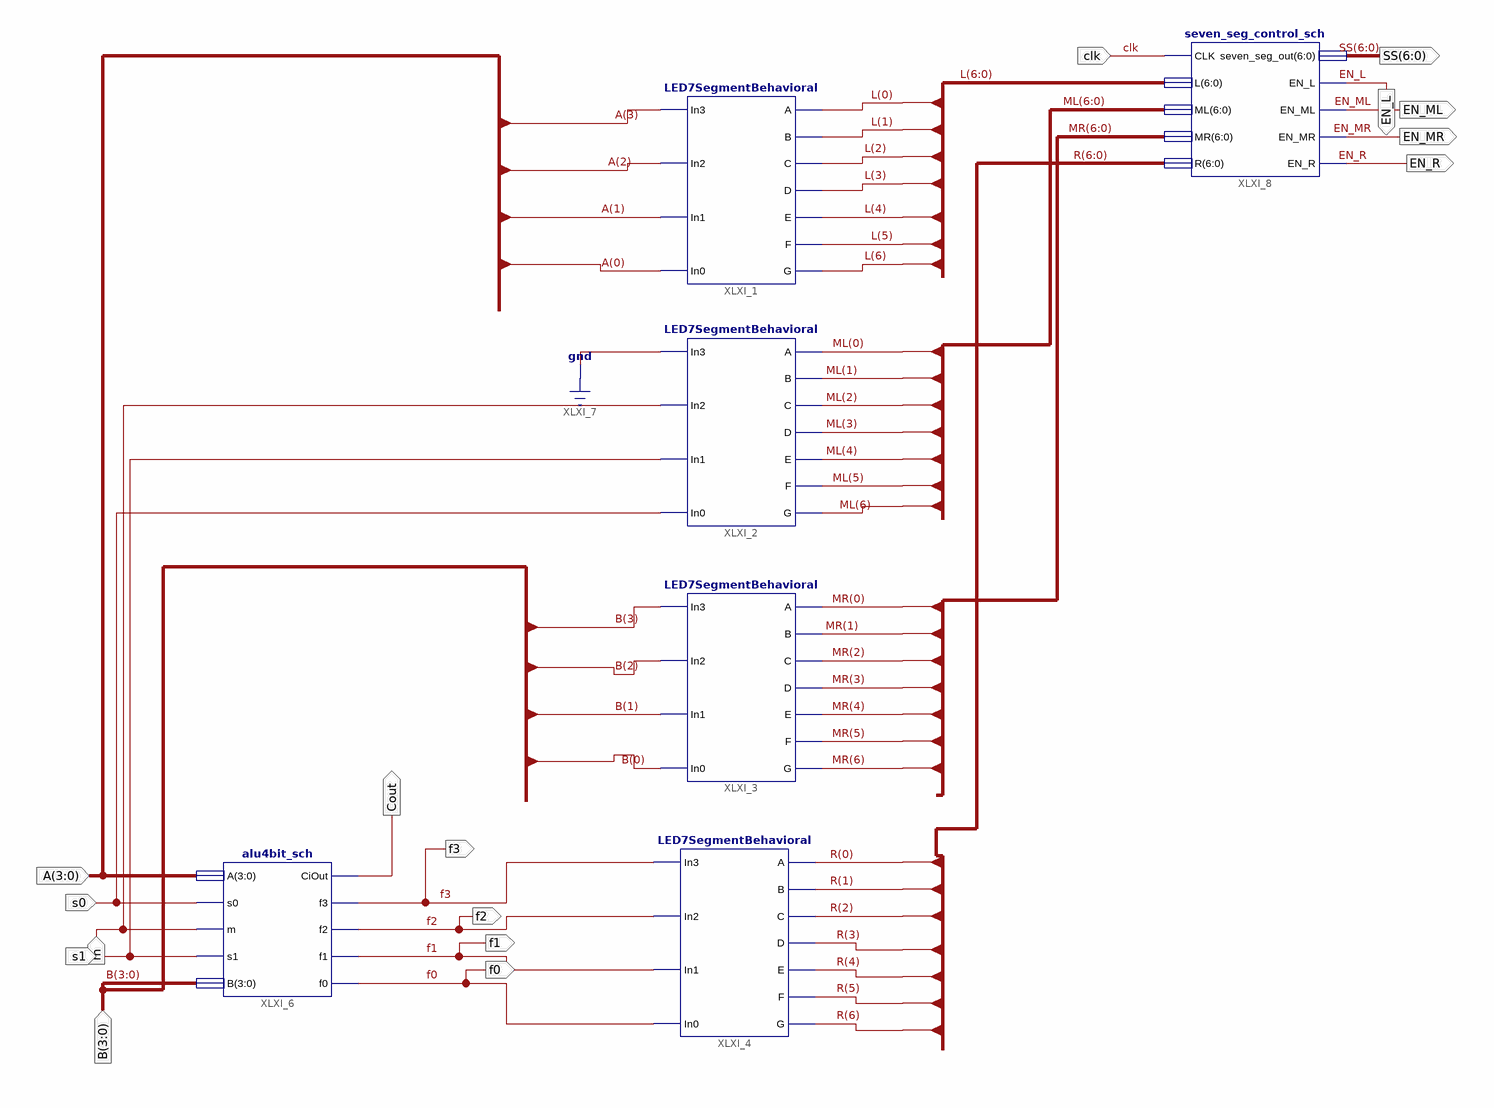
[diagram p0: schematic sheet 1]
// Xilinx ISE schematic alu4bit_board_sch.sch (spartan3e) as structural Verilog: 6 symbols, 16 ports
module alu4bit_board_sch (
  input  [3:0] A,
  input  s0,
  input  m,
  input  s1,
  input  clk,
  input  [3:0] B,
  output f3,
  output f2,
  output f1,
  output f0,
  output Cout,
  output [6:0] SS,
  output EN_L,
  output EN_ML,
  output EN_MR,
  output EN_R
);

  wire [6:0] L, ML, MR, R;

  LED7SegmentBehavioral XLXI_1 (
    .In3(A[3]), .In2(A[2]), .In1(A[1]), .In0(A[0]), .A(L[0]), .B(L[1]), .C(L[2]), .D(L[3]), .E(L[4]),
    .F(L[5]), .G(L[6]));
  LED7SegmentBehavioral XLXI_2 (
    .In3(1'b0), .In2(m), .In1(s1), .In0(s0), .A(ML[0]), .B(ML[1]), .C(ML[2]), .D(ML[3]), .E(ML[4]),
    .F(ML[5]), .G(ML[6]));
  LED7SegmentBehavioral XLXI_3 (
    .In3(B[3]), .In2(B[2]), .In1(B[1]), .In0(B[0]), .A(MR[0]), .B(MR[1]), .C(MR[2]), .D(MR[3]), .E(MR[4]),
    .F(MR[5]), .G(MR[6]));
  LED7SegmentBehavioral XLXI_4 (
    .In3(f3), .In2(f2), .In1(f1), .In0(f0), .A(R[0]), .B(R[1]), .C(R[2]), .D(R[3]), .E(R[4]), .F(R[5]),
    .G(R[6]));
  alu4bit_sch XLXI_6 (.A(A), .s0(s0), .m(m), .s1(s1), .B(B), .CiOut(Cout), .f3(f3), .f2(f2), .f1(f1), .f0(f0));
  seven_seg_control_sch XLXI_8 (
    .CLK(clk), .L(L), .ML(ML), .MR(MR), .R(R), .EN_L(EN_L), .EN_ML(EN_ML), .EN_R(EN_R), .EN_MR(EN_MR),
    .seven_seg_out(SS));
endmodule
